# EAGLE design All_Dreery_Diorth_CE (EAGLE 9.6.2)
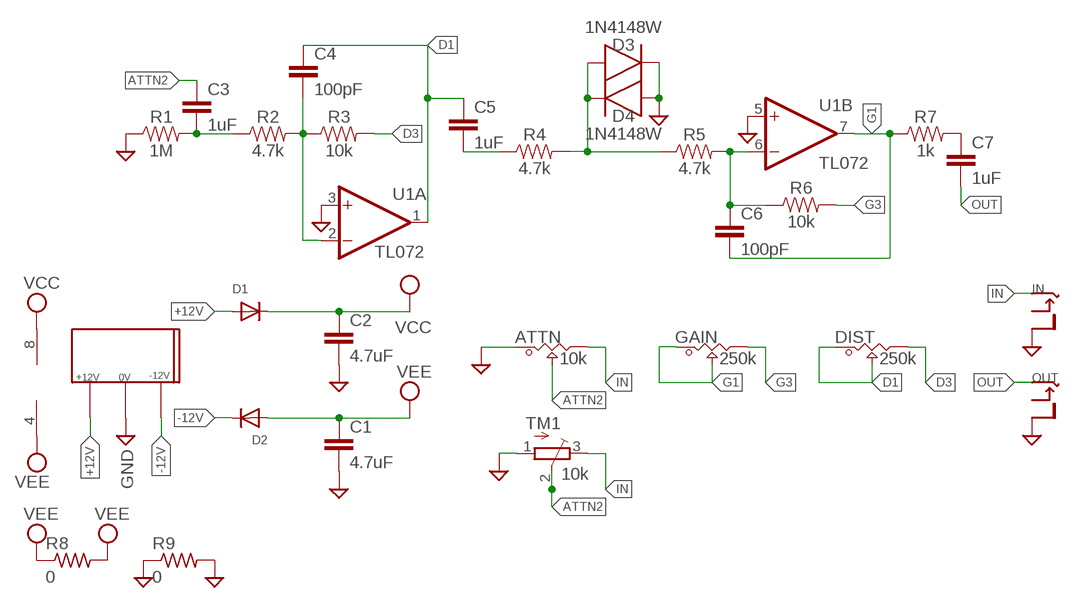
[diagram p0: schematic, sheet 1]

## Parts
ATTN  10k  POT_9MM_SMD  [POT_9MM_SMD]
C1  4.7uF  4.7UF-1206-16V-(+80/-20%)  [1206]
C2  4.7uF  4.7UF-1206-16V-(+80/-20%)  [1206]
C3  1uF  0.1UF-0603-25V-5%  [0603]
C4  100pF  0.1UF-0603-25V-5%  [0603]
C5  1uF  0.1UF-0603-25V-5%  [0603]
C6  100pF  0.1UF-0603-25V-5%  [0603]
C7  1uF  0.1UF-0603-25V-5%  [0603]
D1  DIODESOD-123  [SOD-123]
D2  DIODESOD-123  [SOD-123]
D3  1N4148W  DIODE_1N4148W-7-F_SOD123G  [SOD3715X135]
D4  1N4148W  DIODE_1N4148W-7-F_SOD123G  [SOD3715X135]
DIST  250k  POT_9MM_SMD  [POT_9MM_SMD]
GAIN  250k  POT_9MM_SMD  [POT_9MM_SMD]
R1  1M  RESISTOR0603  [0603]
R2  4.7k  RESISTOR0603  [0603]
R3  10k  RESISTOR0603  [0603]
R4  4.7k  RESISTOR0603  [0603]
R5  4.7k  RESISTOR0603  [0603]
R6  10k  RESISTOR0603  [0603]
R7  1k  RESISTOR0603  [0603]
R8  0  R-US_R0402  [R0402]
R9  0  R-US_R0402  [R0402]
TM1  10k  TRIMPOTTC33X  [TC33X]
U1  TL072  TL072TSSOP  [TSSOP-8]
U$1  EURO_POW_CEH  [EURO_POW_CEH]
U$2  THONKICONN_CE_2X_COMG_NOSW  [1.27MM_CE_2X_COMG_NOSW]

## Nets
+12V: D1.A U$1.+12V
-12V: D2.C U$1.-12V
ATTN2: ATTN.2 C3.1 TM1.2(S)
D1: C4.1 C5.1 DIST.1 DIST.2 U1.1(A:OUT)
D3: DIST.3 R3.2
G1: C6.2 GAIN.1 GAIN.2 R7.1 U1.7(B:OUT)
G3: GAIN.3 R6.2
GND: ATTN.1 C1.2 C2.2 D3.1(C) D4.2(A) R1.1 R9.1 R9.2 TM1.1(A) U1.3(A:+IN) U1.5(B:+IN) U$1.GND U$2.0(S)
IN: ATTN.3 TM1.3(E) U$2.1(T)
N$5: C3.2 R1.2 R2.1
N$6: C4.2 R2.2 R3.1 U1.2(A:-IN)
N$7: C7.1 R7.2
N$8: C5.2 R4.1
N$9: D3.2(A) D4.1(C) R4.2 R5.1
N$10: C6.1 R5.2 R6.1 U1.6(B:-IN)
OUT: C7.2 U$2.2(T)
VCC: C2.1 D1.C U1.8(P:V+)
VEE: C1.1 D2.A R8.1 R8.2 U1.4(P:V-)

## Notes on the sheet
- IN
- OUT

## Library data of the parts
ATTN DIST GAIN = Mech_BO_CE_SW:POT_9MM_SMD
C1 C2 = SparkFun-Capacitors:4.7UF: 4.7µF ceramic capacitors A capacitor is a passive two-terminal electrical component used to store electrical energy temporarily in an electric field.; PROD_ID: CAP-10300
C3-C7 = SparkFun-Capacitors:0.1UF: 0.1µF ceramic capacitors A capacitor is a passive two-terminal electrical component used to store electrical energy temporarily in an electric field.; PROD_ID: CAP-08604; VALUE: 0.1uF
D1 D2 = adafruit:DIODE: Diode SMADIODE - SMA Surface Mount Package 20V 1A Schottky Diode Digikey: 641-1014-6-ND DO-1N4148 - Through Hole Small Current Diode SOD-123 20V 1 A (.5mV Vf) Schottky Diode - Digikey: MBRX120TPMSCT-ND SOD-323 10V 570mA (.38mV Vf, 3ns) Schottky Diode - Digikey: ZLLS410CT-ND SOD-523 30V 30mA Schottky Diode (RB751S-40TE61) - Digikey: RB751S-40TE61CT-ND SOT23-R/W - SOT23 Package (R = Solder Paste/Reflow Ovens, W = Hand-Soldering) BAT54Film 40V 300mA - Digikey: 497-7162-1-ND
D3 D4 = Diode:DIODE_: Diode Rectifier - Popular parts; CATEGORY: Diode; DESCRIPTION: DIODE GEN PURP 100V 300MA SOD123; MANUFACTURER: Diodes Incorporated; SUB-CATEGORY: Rectifier
R1-R7 = SparkFun-Resistors:RESISTOR: Generic Resistor Package
R8 R9 = adafruit:R-US_: RESISTOR, American symbol
TM1 = adafruit:TRIMPOT: SMT trimmer potentiometer part number TC33X http://www.ladyada.net/library/eagle
U1 = MusicThingModular:TL072: Generic Dual Op Amp
U$1 = 2.54mm_PowHeader_SMD:EURO_POW_CEH: Eurorack Power Header Reduced Card Edge Surface Mount Pads
U$2 = THONKICONN_BE:THONKICONN_CE_2X_COMG_NOSW

## Board
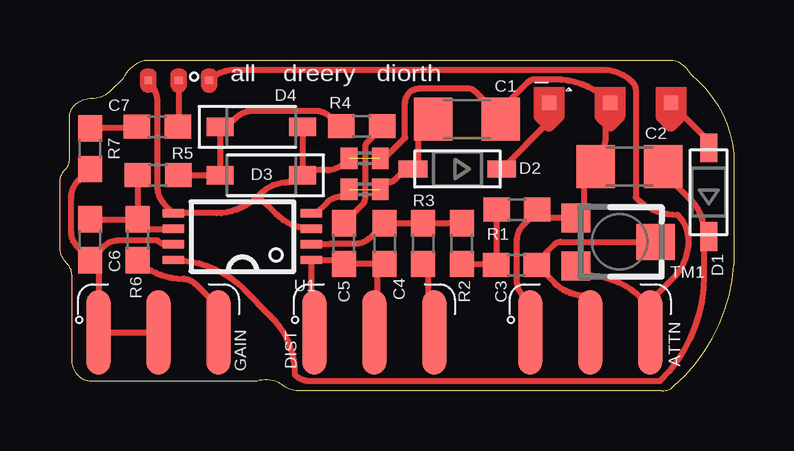
[diagram p1: board, top side]

Size 28.1 x 13.8 mm. Coordinates in mm from the lower left corner, seen from the top.
Outline: 25.12,0 9.92,0 arc-45 9.2,0.3 arc45 8.22,0.4 1.28,0.4 arc-45 0.8,0.6 arc-45 0.5,1.32 0.5,4.82 arc45 0.3,5.3 arc-45 0,6.02 0,8.72 arc-45 0.2,9.2 arc45 0.4,9.68 0.4,11.42 arc-45 0.6,11.9 arc-45 1.32,12.2 arc45 2.14,12.54 2.65,13.05 arc-45 3.5,13.8 25.58,13.8 arc-45 26.3,13.2 arc-45 28.1,9.9 28.1,5.25 arc-45 25.6,0.2 arc-45 25.12,0
Copper layers (1*16): Top 0.035mm / dielectric 1.5mm / Bottom 0.035mm
Design rules "default *": minimum track width 6mil, minimum drill 0.35mm, track to track 6mil, track to pad 6mil, pad to pad 6mil, via to via 6mil, smd to smd 6mil, copper to edge 10mil, drill to drill 6mil, minimum pad ring 10mil, minimum via ring 8mil, stop-mask expansion 4mil, vias tented up to drill 0mil, thermal gap 10mil

### Footprints (pad centres in the part's own frame; a part is rotated, then mirrored left to right if it is on the bottom)
POT_9MM_SMD = smd 0.991 x 3.505: 1 -2.5,0; 2 0,0; 3 2.5,0
1206 = smd 1.6 x 1.8: 1 -1.4,0; 2 1.4,0
0603 = smd 1.1 x 1: 1 -0.85,0; 2 0.85,0
SOD-123 = smd 1.2 x 0.7: A 1.85,0; C -1.85,0
SOD3715X135 = smd 1.127 x 0.784: 1 -1.722,0; 2 1.722,0
R0402 = smd 0.7 x 0.9: 1 -0.65,0; 2 0.65,0
TC33X = smd 1.2 x 1.2: 1 -1,-1.825; 3 1,-1.825 | smd 1.5 x 1.6: 2 0,1.5
TSSOP-8 = smd 0.9 x 0.35: 1 -2.875,0.975; 2 -2.875,0.325; 3 -2.875,-0.325; 4 -2.875,-0.975; 5 2.875,-0.975; 6 2.875,-0.325; 7 2.875,0.325; 8 2.875,0.975
EURO_POW_CEH = smd 0.6 x 0.6: +12V 0,-3.175; -12V 5.08,-3.175; GND 2.54,-3.175
1.27MM_CE_2X_COMG_NOSW = smd 0.318 x 0.318: 0 2.54,0; 1 0,0; 2 1.27,0

### Placement (x,y rotation side)
ATTN  22.11,2.44 0 top
C1  16.97,11.33 0 top
C2  23.74,9.35 180 top
C3  19.03,5.24 180 top
C4  13.54,6.14 90 top
C5  11.84,6.14 90 top
C6  1.25,6.3 270 top
C7  4.06,11.01 0 top
D1  27.05,8.28 90 top
D2  16.57,9.25 180 top
D3  8.4,8.99 180 top
D4  8.4,11.01 0 top
DIST  13.11,2.44 0 top
GAIN  4.11,2.44 0 top
R1  19.05,7.56 180 top
R2  16.76,6.14 90 top
R3  15.14,6.14 270 top
R4  12.58,11.04 180 top
R5  4.09,8.99 180 top
R6  3.24,6.3 270 top
R7  1.25,10.1 90 top
R8  12.7,8.4 0 top
R9  12.7,9.7 0 top
TM1  23.34,6.21 270 top
U1  7.61,6.43 180 top
U$1  25.47,8.83 180 top
U$2  6.22,12.95 180 top

### Tracks (layer width: path | path; a pad name or v marks a point on that pad's centre or on a via)
+12V
  Top 0.254: U$1.+12V 27.05,10.43 D1.A
-12V
  Top 0.254: D2.C 20.39,11.22 U$1.-12V
ATTN2
  Top 0.254: ATTN.2 22.11,3.74 21.88,3.97 arc-45 20.63,4.49 C3.1 19.88,5.37 20.6,6.09 arc-45 20.89,6.21 TM1.2
D1
  Top 0.254: DIST.2 13.21,2.54 13.21,4.96 C4.1 C5.1 11.68,5.46 U1.1 10.48,2.56 DIST.1
D3
  Top 0.254: R3.2 15.34,5.09 15.34,2.71 DIST.3
G1
  Top 0.254: U1.7 4.48,6.11 arc-45 4.06,6.28 2.49,6.28 arc45 1.79,5.99 C6.2 | C6.2 1.61,5.09 GAIN.1 GAIN.2 | C6.2 1.25,5.5 0.7,6.05 arc-45 0.47,6.62 0.47,8.06 arc-45 0.76,8.76 R7.1
G3
  Top 0.254: R6.2 arc45 5.12,4.67 arc-45 5.65,4.45 6.46,3.64 6.46,2.59 GAIN.3
GND  (1 unrouted)
  Top 0.254: D4.2 10.12,9.2 | 10.12,9.2 D3.1 9.82,8.99 9.52,8.69 arc45 8.34,8.2 8.27,8.13 | 8.27,8.13 arc-45 6.52,7.41 U1.5 4.36,7.78 arc-45 4.07,8.48 4.07,12.01 arc45 U$2.0 | U1.3 arc-45 9.05,7.35 8.27,8.13 | ATTN.1 19.31,2.74 19.31,3.96 arc-45 19.05,4.59 19.05,6.24 arc-45 19.34,6.94 19.93,7.53 | 19.93,7.53 20.25,7.21 TM1.1 21.84,7.54 21.84,8.85 C2.2 22.34,9.85 22.61,10.12 arc45 22.73,10.41 22.73,11.8 U$1.GND 22.93,12.03 arc45 20.63,12.98 19.79,12.98 arc45 19.51,12.87 18.37,11.73 C1.2 18.37,11.43 17.3,12.49 arc45 17.02,12.61 14.99,12.61 arc90 14.39,12.01 14.39,10.58 arc-45 14.37,10.54 13.54,9.7 R9.2 | 19.93,7.53 R1.1 | R9.1 11.84,9.49 arc-45 11.14,9.2 10.12,9.2
IN
  Top 0.254: U$2.1 arc-45 7.28,13.39 22.63,13.39 arc-45 23.87,12.88 arc-45 24,12.56 24,8.06 arc45 25.75,7.34 arc-45 26.2,6.25 arc-45 25.55,4.67 24.61,3.74 ATTN.3 24.46,2.59 24.46,3.64 24.27,3.84 arc45 21.91,4.81 TM1.3
N$5
  Top 0.254: R2.1 18.1,5.29 | 18.1,5.29 18.13,5.29 C3.2 | R1.2 18.2,5.39 18.1,5.29
N$6
  Top 0.254: U1.2 11.21,6.11 11.22,6.12 12.26,6.12 arc45 12.96,6.41 C4.2 R3.1 R2.2
N$7
  Top 0.254: C7.1 3.15,10.95 R7.2
N$8
  Top 0.254: C5.2 12.6,7.75 arc45 12.72,8.04 12.72,10.14 arc-45 12.81,10.35 13.43,10.97 R4.1
N$9
  Top 0.254: R5.1 D3.2 D4.1 6.97,11.01 7.35,11.39 arc-45 8.06,11.68 10.67,11.68 arc-45 11.23,11.45 11.64,11.04 R4.2
N$10
  Top 0.254: C6.1 R6.1 3.3,7.15 | U1.6 3.69,6.75 3.3,7.15 | R5.2 3.24,7.21 3.3,7.15
OUT
  Top 0.254: U$2.2 4.95,11.05 C7.2
VCC
  Top 0.254: U1.8 arc-45 7.66,4.24 8.77,3.13 arc-45 9.79,0.67 arc45 10.42,0.41 25.03,0.41 arc45 26.85,4.8 26.85,6.23 D1.C 26.85,6.63 arc45 26.29,7.98 25.14,9.13 C2.1
VEE  (1 unrouted)
  Top 0.254: R8.1 11.75,8.1 arc45 11.12,7.84 10.69,7.41 U1.4 | R8.2 13.65,8.7 13.73,8.7 arc45 13.94,8.79 14.4,9.25 D2.A 14.94,9.46 14.94,10.7 C1.1

### Text on the board
tPlace: all | dreery | diorth | –